# Altium project ESM-111A FBB.PrjPcb
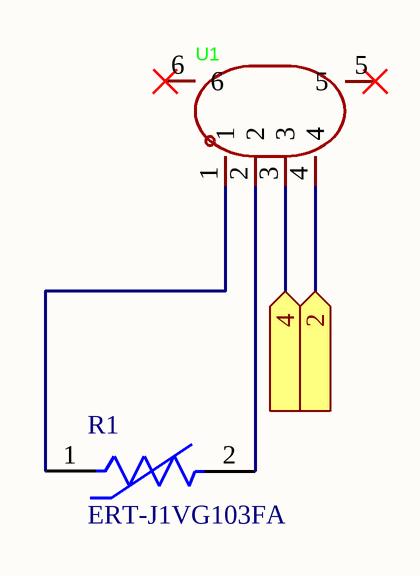
[diagram p0: FBB_Sch.SchDoc]
1 sheet, 2 parts. Net scope: flat (ports and power ports of the same name join across sheets).
Board file: FBB_PCB.PcbDoc

## Sheet FBB_Sch.SchDoc: FBB
size A4; Author: Zixi Chen; DocumentNumber: 1; Revision: 1; SheetNumber: 1; SheetTotal: 1

### Parts
R1  ERT-J1VG103FA  [FP-ERTJ1-MFG]
U1  WAFER-MX1.25-4PWB  [CONN-SMD_4P-P1.25_WAFER-MX1.25-4PWB]  (value not drawn)

### Ports
2 (in), 4 (in)

### Nets
NetR1_1: R1.1 U1.1
NetR1_2: R1.2 U1.2
NetU1_3: U1.3 ; port 4
NetU1_4: U1.4 ; port 2

Not connected (* = marked no-connect by the designer): U1 5* 6*

### Library data of the parts
R1 = CMP-05419-000001-1: THERMISTOR NTC 10KOHM 3380K 0603; Resistance: 10kR; Max Power Dissipation: 100mW; Resistance Tolerance: 1%; Case Code (Imperial): 0603; Height: 0.8mm; Case/Package: 0603; Depth: 0.8mm; Min Operating Temperature: -40°C; Accuracy: 1%; Series: ERT-J; Termination: SMD/SMT; Length: 1.6mm; Number of Pins: 2; Lead Free: Lead Free; Power Rating: 100mW; Package Quantity: 4000; RoHS Compliant: Yes; Max Operating Temperature: 125°C; Width: 800um; REACH SVHC: No SVHC; Packaging: Tape and Reel; Tolerance: 1%; Mount: Surface Mount; Case Code (Metric): 1608; Radiation Hardening: No
U1 = CMP-012-000000-1: Manufacturer: XUNPU(讯普); X-Length of Bottom Edge on Board (Spacing Line): 10mm; Supplementary Features: Auxiliary Solder Pin; Add into BOM: yes; Plastic Material: LCP; Current Rating: 1A; Reference Series: PicoBlade(MX 1.25); Voltage Rating: 125V; Z-Height of the Board: 3.6mm; Pitch: 1.25mm; Number of PINs Per Row: 4; Pins Structure: 1x4P; Y-Width of Bottom Edge on Board: 5.25mm; Operating Temperature: -25℃~+85℃; Number of Rows: 1; Color: Beige; LCSC Part Name: 1x4P 间距:1.25mm 卧贴 系列:PicoBlade(MX 1.25); Symbol: WAFER-MX1.25-4PWB; Contact Material: Brass; Number of Pins: 4P; Source: FBB.SchLib; Contact Plating: Tin; Supplier Part: C3029361; Mounting Type: Surface Mount, Right Angle; JLCPCB Part Class: Extended Part; Device: WAFER-MX1.25-4PWB; Supplier Footprint: SMD,P=1.25mm,卧贴; Design Item ID: WAFER-MX1.25-4PWB; Datasheet: https://item.szlcsc.com/datasheet/WAFER-MX1.25-4PWB/3561373.html; Flame Retardant Rating: -; Row Spacing: -; Manufacturer Part: WAFER-MX1.25-4PWB; Convert to PCB: yes